# EAGLE design colpitts (EAGLE 9.6.2)
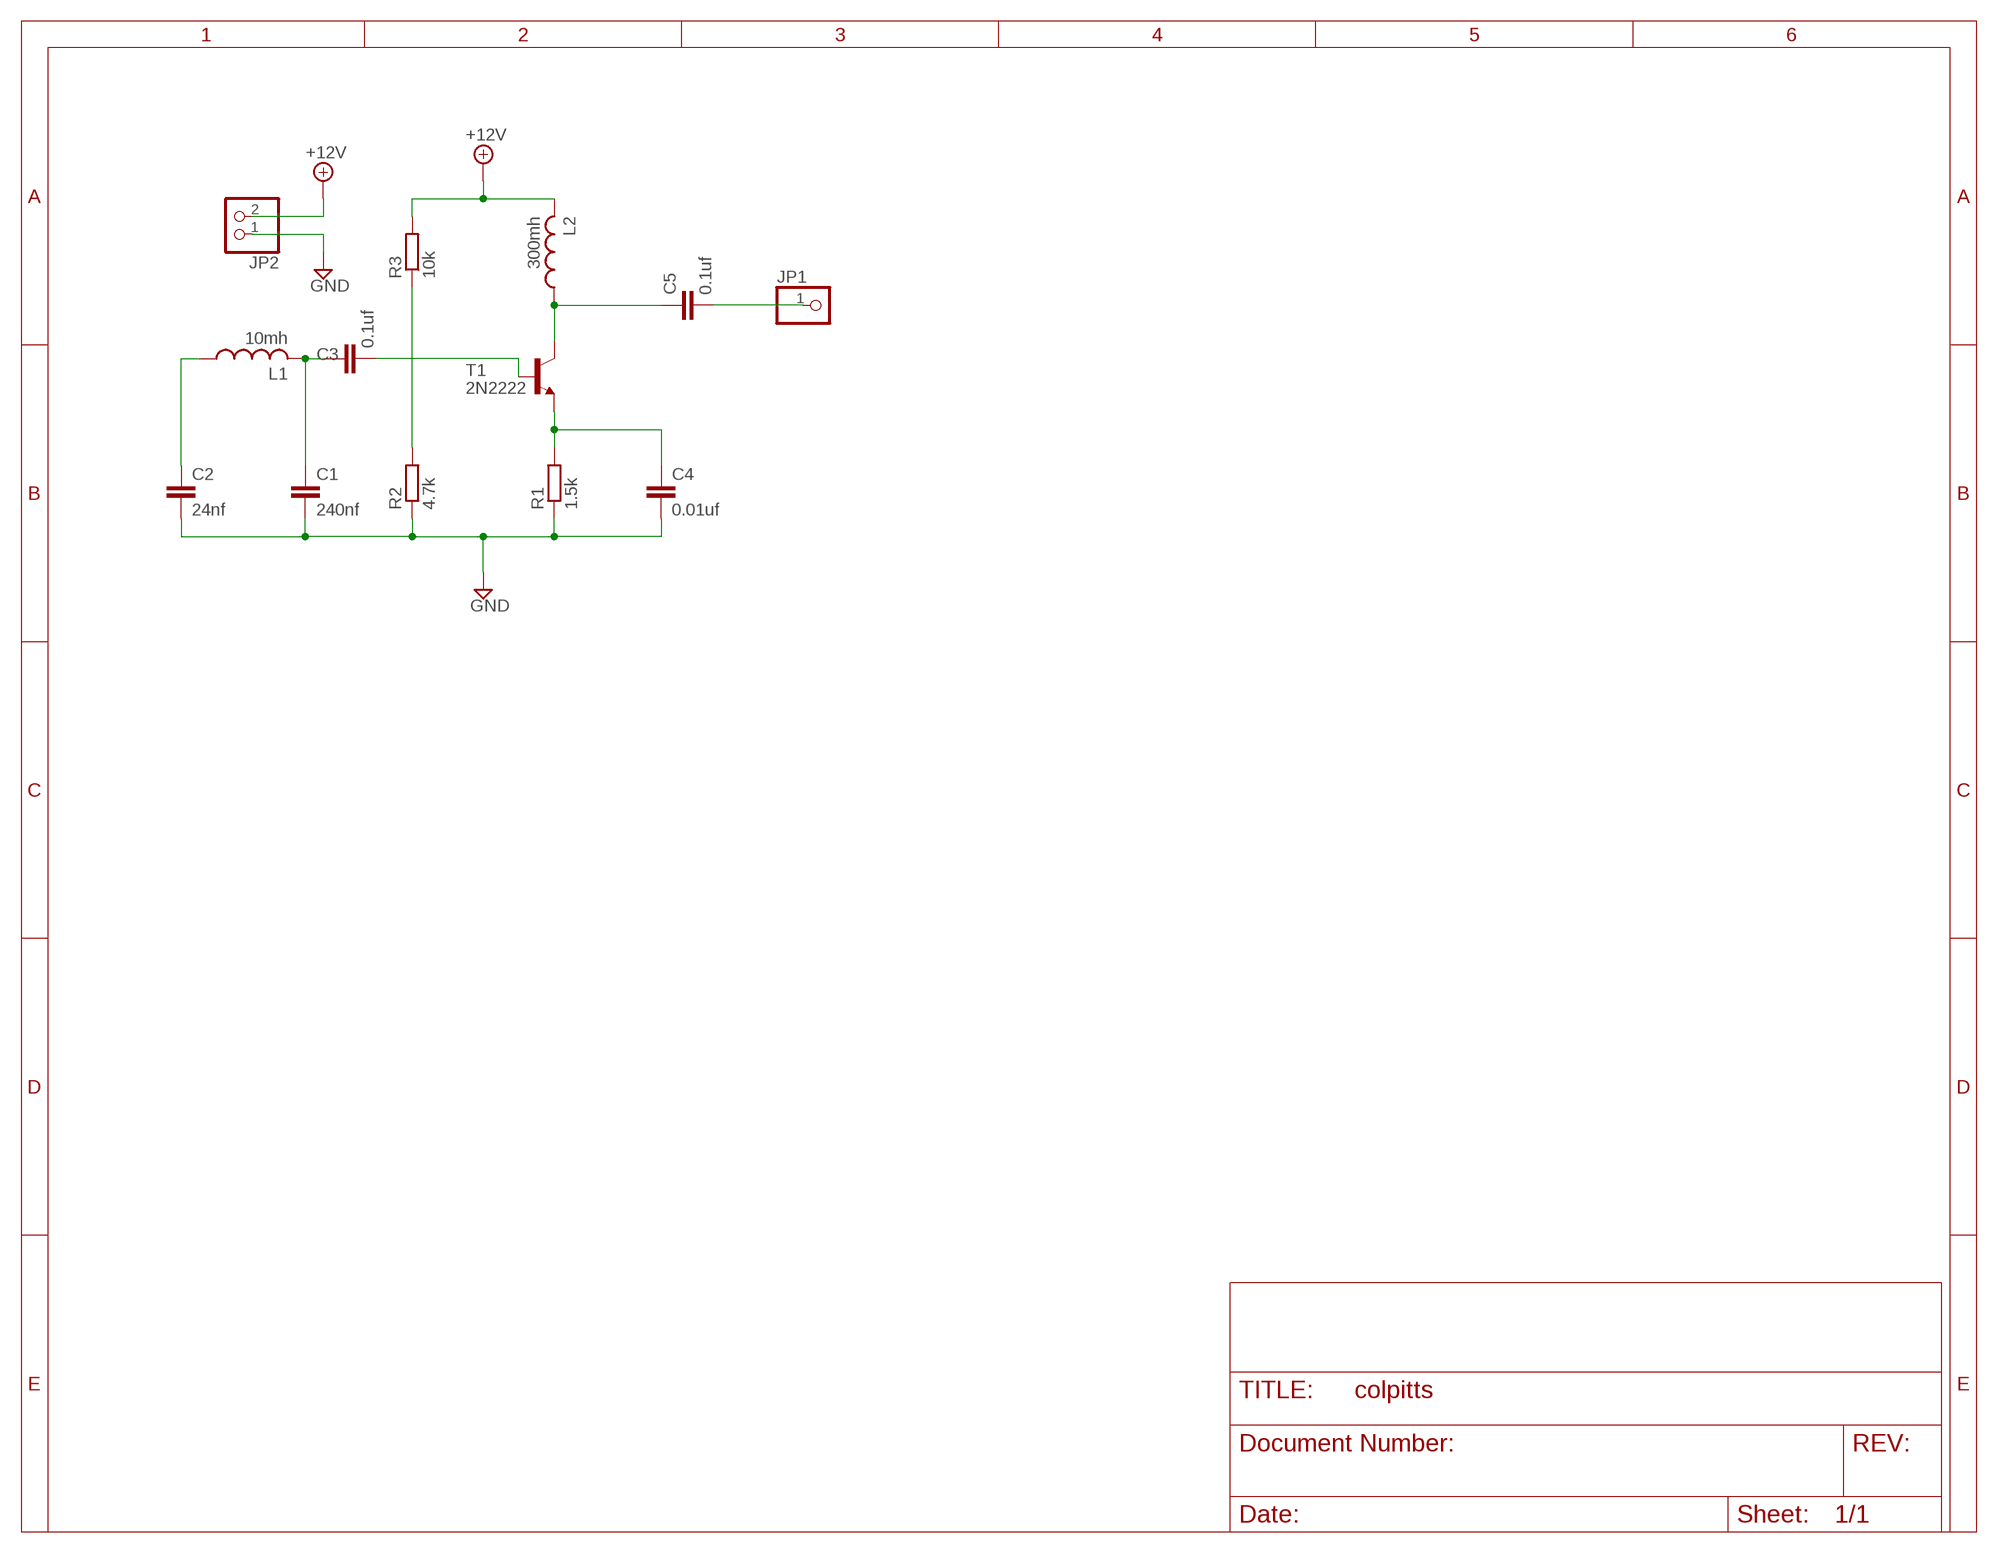
[diagram p0: schematic, sheet 1]

## Parts
C1  240nf  C-EU050-024X044  [C050-024X044]
C2  24nf  C-EU050-024X044  [C050-024X044]
C3  0.1uf  C-EU050-024X044  [C050-024X044]
C4  0.01uf  C-EU050-024X044  [C050-024X044]
C5  0.1uf  C-EU050-024X044  [C050-024X044]
JP1  PINHD-1X1  [1X01]
JP2  PINHD-1X2  [1X02]
L1  10mh  L-US0207/10  [0207/10]
L2  300mh  L-US0207/10  [0207/10]
R1  1.5k  R-EU_0204/7  [0204/7]
R2  4.7k  R-EU_0204/7  [0204/7]
R3  10k  R-EU_0204/7  [0204/7]
T1  2N2222  [TO18]

## Nets
+12V: JP2.2 L2.2 R3.2
GND: C1.2 C2.2 C4.2 JP2.1 R1.1 R2.1
N$1: C2.1 L1.1
N$2: C1.1 C3.1 L1.2
N$3: C3.2 T1.2(B)
N$4: R2.2 R3.1
N$5: C4.1 R1.2 T1.1(E)
N$6: C5.2 JP1.1
N$8: C5.1 L2.1 T1.3(C)

## Library data of the parts
C1-C5 = rcl:C-EU: CAPACITOR, European symbol; SPICEPREFIX: C
JP1 = pinhead:PINHD-1X1: PIN HEADER
JP2 = pinhead:PINHD-1X2: PIN HEADER
L1 L2 = rcl:L-US: INDUCTOR, American symbol; SPICEPREFIX: L
R1-R3 = rcl:R-EU_: RESISTOR, European symbol; SPICEPREFIX: R
T1 = transistor:2N2222: NPN TRANSISTOR

## Board
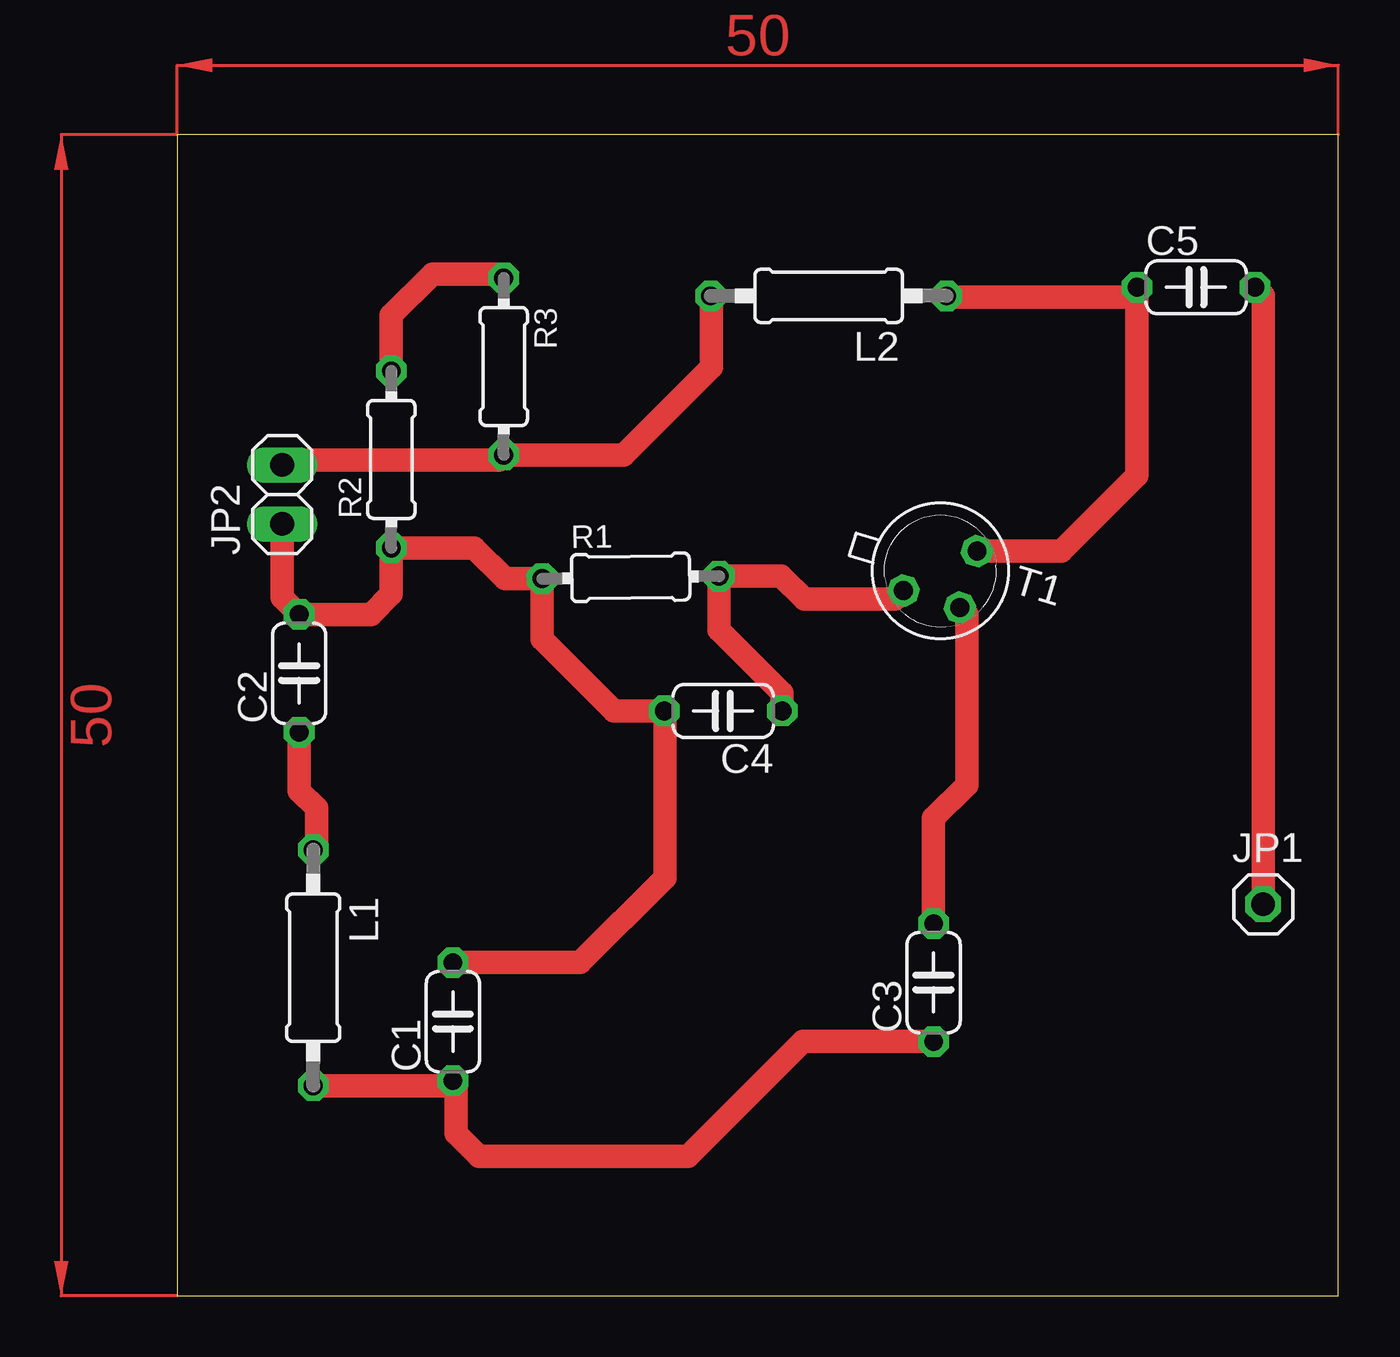
[diagram p1: board, top side]

Size 50 x 50 mm. Coordinates in mm from the lower left corner, seen from the top.
Outline: 0,0 50,0 50,50 0,50 0,0
Copper layers (1*16): Top 0.035mm / dielectric 1.5mm / Bottom 0.035mm
Design rules "default": minimum track width 6mil, minimum drill 0.35mm, track to track 6mil, track to pad 6mil, pad to pad 6mil, via to via 6mil, smd to smd 6mil, copper to edge 40mil, drill to drill 6mil, minimum pad ring 10mil, minimum via ring 8mil, stop-mask expansion 4mil, vias tented up to drill 0mil, thermal gap 10mil

### Footprints (pad centres in the part's own frame; a part is rotated, then mirrored left to right if it is on the bottom)
C050-024X044 = drill 0.813 octagon: 1 -2.54,0; 2 2.54,0
1X01 = drill 1.016 octagon: 1 0,0
1X02 = drill 1.016 long: 1 -1.27,0; 2 1.27,0
0207/10 = drill 0.813 octagon: 1 -5.08,0; 2 5.08,0
0204/7 = drill 0.813 octagon: 1 -3.81,0; 2 3.81,0
TO18 = drill 0.813 octagon: 1 -1.27,-1.27; 2 1.27,-1.27; 3 1.27,1.27

### Placement (x,y rotation side)
C1  11.87,11.81 90 top
C2  5.25,26.81 90 top
C3  32.57,13.49 90 top
C4  23.51,25.19 180 top
C5  43.87,43.43 0 top
JP1  46.76,16.86 0 top
JP2  4.52,34.51 90 top
L1  5.86,14.13 270 top
L2  28.05,43.06 180 top
R1  19.52,30.94 0.8 top
R2  9.22,36.02 90 top
R3  14.06,40.02 270 top
T1  32.86,31.22 343.1 top

### Tracks (layer width: path | path; a pad name or v marks a point on that pad's centre or on a via)
+12V
  Top 1.016: L2.2 23,43.03 23,40 19.21,36.21 R3.2 13.85,36 4.74,36 JP2.2
GND
  Top 1.016: JP2.1 4.52,30.08 C2.2 8.35,29.35 9.22,30.22 R2.1 12.79,32.21 14.11,30.89 R1.1 15.71,28.29 18.81,25.19 C4.2 21,25.16 21,18 17.35,14.35 C1.2
N$1
  Top 1.016: C2.1 5.25,21.75 6,21 6,19.35 L1.1
N$2
  Top 1.016: L1.2 11.65,9.05 C1.1 12,9.14 12,7 13,6 22,6 26.95,10.95 C3.1
N$3
  Top 1.016: T1.2 34,29.34 34,22 32.57,20.57 C3.2
N$4
  Top 1.016: R2.2 9.22,42.22 11,44 13.89,44 R3.1
N$5
  Top 1.016: T1.1 30.9,30 27,30 26.01,30.99 R1.2 23.33,28.67 26.05,25.95 C4.1
N$6
  Top 1.016: C5.2 46.76,43.08 JP1.1
N$8
  Top 1.016: L2.1 33.19,43 40.9,43 C5.1 41.33,35.33 38.07,32.07 T1.3
(copper drawn outside any net)
  shapes: Top area x2